# Altium schematic sheet FX_Peripherals.SchDoc: FX2.00
size A4; Date: 2018.11.13; Author: 淹死的鱼; Engineer: 淹死的鱼; Address2: V2.00; DocumentNumber: A4
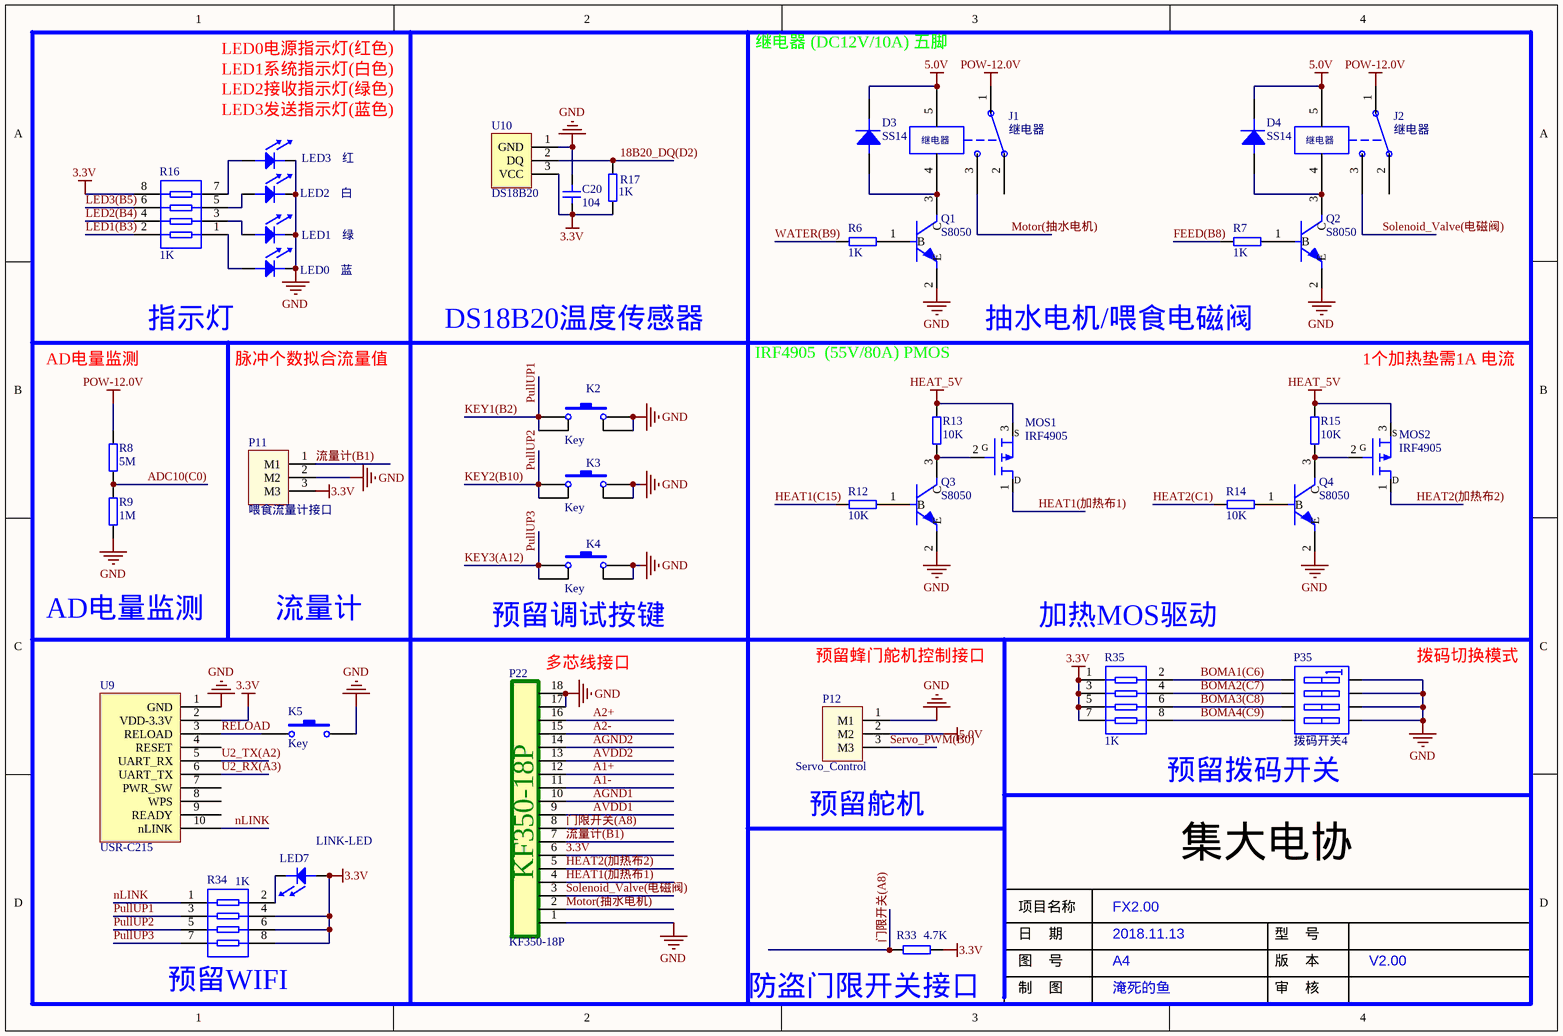
[diagram p0: FX_Peripherals.SchDoc]

## Parts
C20  104  [0805C]
D3  SS14  [SMA/DO-214AC]
D4  SS14  [SMA/DO-214AC]
J1  继电器  [继电器(小型)]
J2  继电器  [继电器(小型)]
K2  Key  [SW_PB4_DIP]
K3  Key  [SW_PB4_DIP]
K4  Key  [SW_PB4_DIP]
K5  Key  [贴片按键]
LED0  蓝  [0805LED]
LED1  绿  [0805LED]
LED2  白  [0805LED]
LED3  红  [0805LED]
LED7  LINK-LED  [0805LED]
MOS1  IRF4905  [IRF4905(PMOS)]
MOS2  IRF4905  [IRF4905(PMOS)]
P11  喂食流量计接口  [接线端子(2.54mm)-3PIN]
P12  Servo_Control  [接线端子(2.54mm)-3PIN]
P22  KF350-18P  [KF350-18P]
P35  拨码开关4  [拨码开关(4位直插)]
Q1  S8050  [SOT-23]
Q2  S8050  [SOT-23]
Q3  S8050  [SOT-23]
Q4  S8050  [SOT-23]
R6  1K  [0805R]
R7  1K  [0805R]
R8  5M  [0805R]
R9  1M  [0805R]
R12  10K  [0805R]
R13  10K  [0805R]
R14  10K  [0805R]
R15  10K  [0805R]
R16  1K  [排阻(4位贴片)]
R17  1K  [0805R]
R33  4.7K  [0805R]
R34  1K  [排阻(4位贴片)]
R35  1K  [排阻(4位贴片)]
U9  USR-C215  [USR-C215]
U10  DS18B20  [TO-92]

## Nets
3.3V: C20.2 LED7.1 P11.3(M3) P22.6 R16.8 R17.1 R33.2 R34.4 R34.6 R34.8 R35.1 R35.3 R35.5 R35.7 U9.2(VDD-3.3V) U10.3(VCC)
5.0V: D3.2 D4.2 J1.5 J2.5 P12.2(M2)
GND: C20.1 K2.2 K2.3 K3.2 K3.3 K4.2 K4.3 K5.2 LED0.2 LED1.2 LED2.2 LED3.2 P11.2(M2) P12.1(M1) P22.1 P22.17 P22.18 P35.5(B4) P35.6(B3) P35.7(B2) P35.8(B1) Q1.2(E) Q2.2(E) Q3.2(E) Q4.2(E) R9.2 U9.1(GND) U10.1(GND)
HEAT_5V: MOS1.3(S) MOS2.3(S) R13.1 R15.1
POW-12.0V: J1.1 J2.1 R8.1
18B20_DQ(D2): R17.2 U10.2(DQ)
A1+: P22.12
A1-: P22.11
A2+: P22.16
A2-: P22.15
ADC10(C0): R8.2 R9.1
AGND1: P22.10
AGND2: P22.14
AVDD1: P22.9
AVDD2: P22.13
BOMA1(C6): P35.1(A1) R35.2
BOMA2(C7): P35.2(A2) R35.4
BOMA3(C8): P35.3(A3) R35.6
BOMA4(C9): P35.4(A4) R35.8
FEED(B8): R7.2
HEAT1(C15): R12.2
HEAT1(加热布1): MOS1.1(D) P22.4
HEAT2(C1): R14.2
HEAT2(加热布2): MOS2.1(D) P22.5
KEY1(B2): K2.1 K2.4 R34.3  [also labelled PullUP1]
KEY2(B10): K3.1 K3.4 R34.5  [also labelled PullUP2]
KEY3(A12): K4.1 K4.4 R34.7  [also labelled PullUP3]
LED1(B3): R16.2
LED2(B4): R16.4
LED3(B5): R16.6
Motor(抽水电机): J1.3 P22.2
nLINK: R34.1 U9.10(nLINK)
RELOAD: K5.1 U9.3(RELOAD)
Servo_PWM(B0): P12.3(M3)
Solenoid_Valve(电磁阀): J2.3 P22.3
U2_RX(A3): U9.6(UART_TX)
U2_TX(A2): U9.5(UART_RX)
WATER(B9): R6.2
流量计(B1): P11.1(M1) P22.7
门限开关(A8): P22.8 R33.1
NetD3_1: D3.1 J1.4 Q1.3(C)
NetD4_1: D4.1 J2.4 Q2.3(C)
NetLED0_1: LED0.1 R16.1
NetLED1_1: LED1.1 R16.3
NetLED2_1: LED2.1 R16.5
NetLED3_1: LED3.1 R16.7
NetLED7_2: LED7.2 R34.2
NetMOS1_2: MOS1.2(G) Q3.3(C) R13.2
NetMOS2_2: MOS2.2(G) Q4.3(C) R15.2
NetQ1_1: Q1.1(B) R6.1
NetQ2_1: Q2.1(B) R7.1
NetQ3_1: Q3.1(B) R12.1
NetQ4_1: Q4.1(B) R14.1

Not connected (* = marked no-connect by the designer): J1 2; J2 2; U9 4(RESET) 7(PWR_SW) 8(WPS) 9(READY)

## Notes on the sheet
- LED1系统指示灯(白色)
- LED2接收指示灯(绿色)
- (near LED3) LED3发送指示灯(蓝色)
- LED0电源指示灯(红色)
- 继电器 (DC12V/10A) 五脚
- AD电量监测
- 指示灯
- 脉冲个数拟合流量值
- DS18B20温度传感器
- IRF4905  (55V/80A) PMOS
- 抽水电机/喂食电磁阀
- 1个加热垫需1A 电流
- 流量计
- (near K4) 预留调试按键
- (near R35) 加热MOS驱动
- (near P22) 多芯线接口
- 预留蜂门舵机控制接口
- 拨码切换模式
- 预留拨码开关
- (near P12) 预留舵机
- (near R34) 预留WIFI
- (near R33) 防盗门限开关接口
- 集大电协
- 项目名称
- 日    期
- 图    号
- 版    本
- 型    号
- 制    图
- 审    核

## Library data of the parts
C20 = Cap1: 无极贴片电容
D3 D4 = Diode: 二极管
K2-K4 = 轻触开关: 四脚按键
K5 = 贴片按键: 轻触开关
LED0-LED3 LED7 = LED: 发光二极管
MOS1 MOS2 = PMOS
P11 P12 = 接线端子-3PIN: 3PIN
P22 = 接线端子KF350-18P
P35 = 拨码开关4: 4位拨码开关
Q1-Q4 = NPN: NPN三极管
R6-R9 R12-R15 R17 R33 = Res: 电阻
R16 R34 R35 = Res-4: 排阻
U9 = USR-C215: WIFI模块
U10 = DS18B20: 数字温度传感器